# EAGLE schematic Circuit (EAGLE 8.2.2)
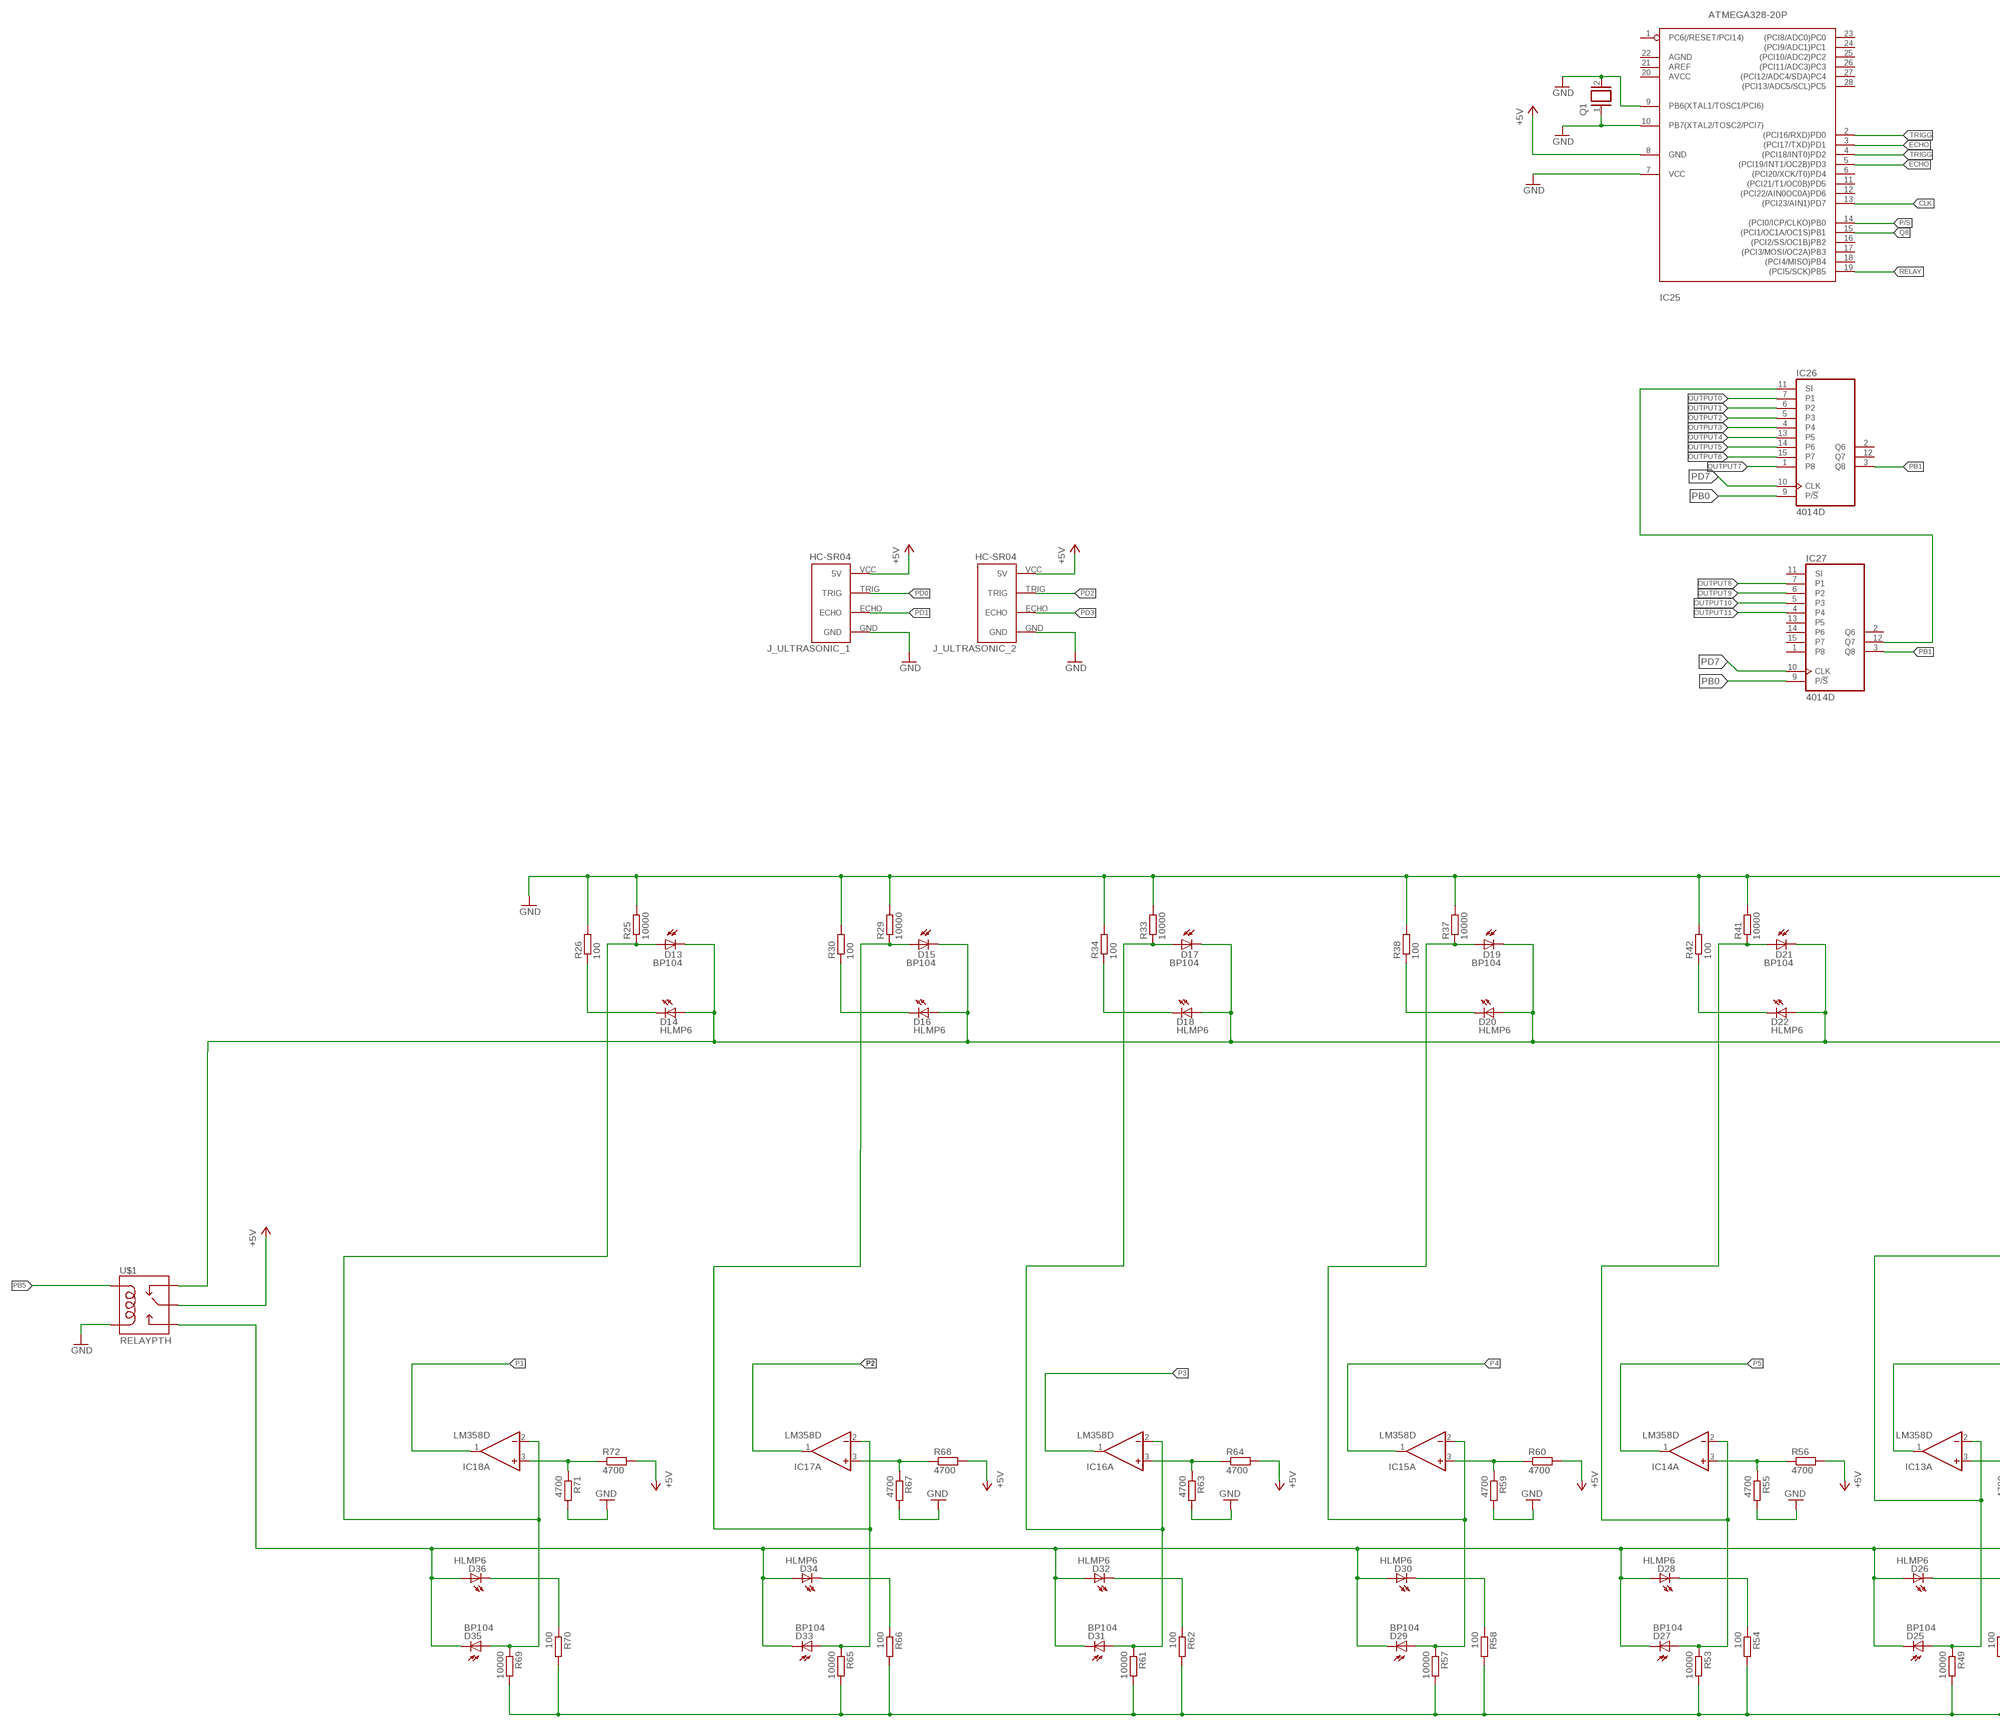
[diagram p0: schematic, sheet 1, part 1 of 2]
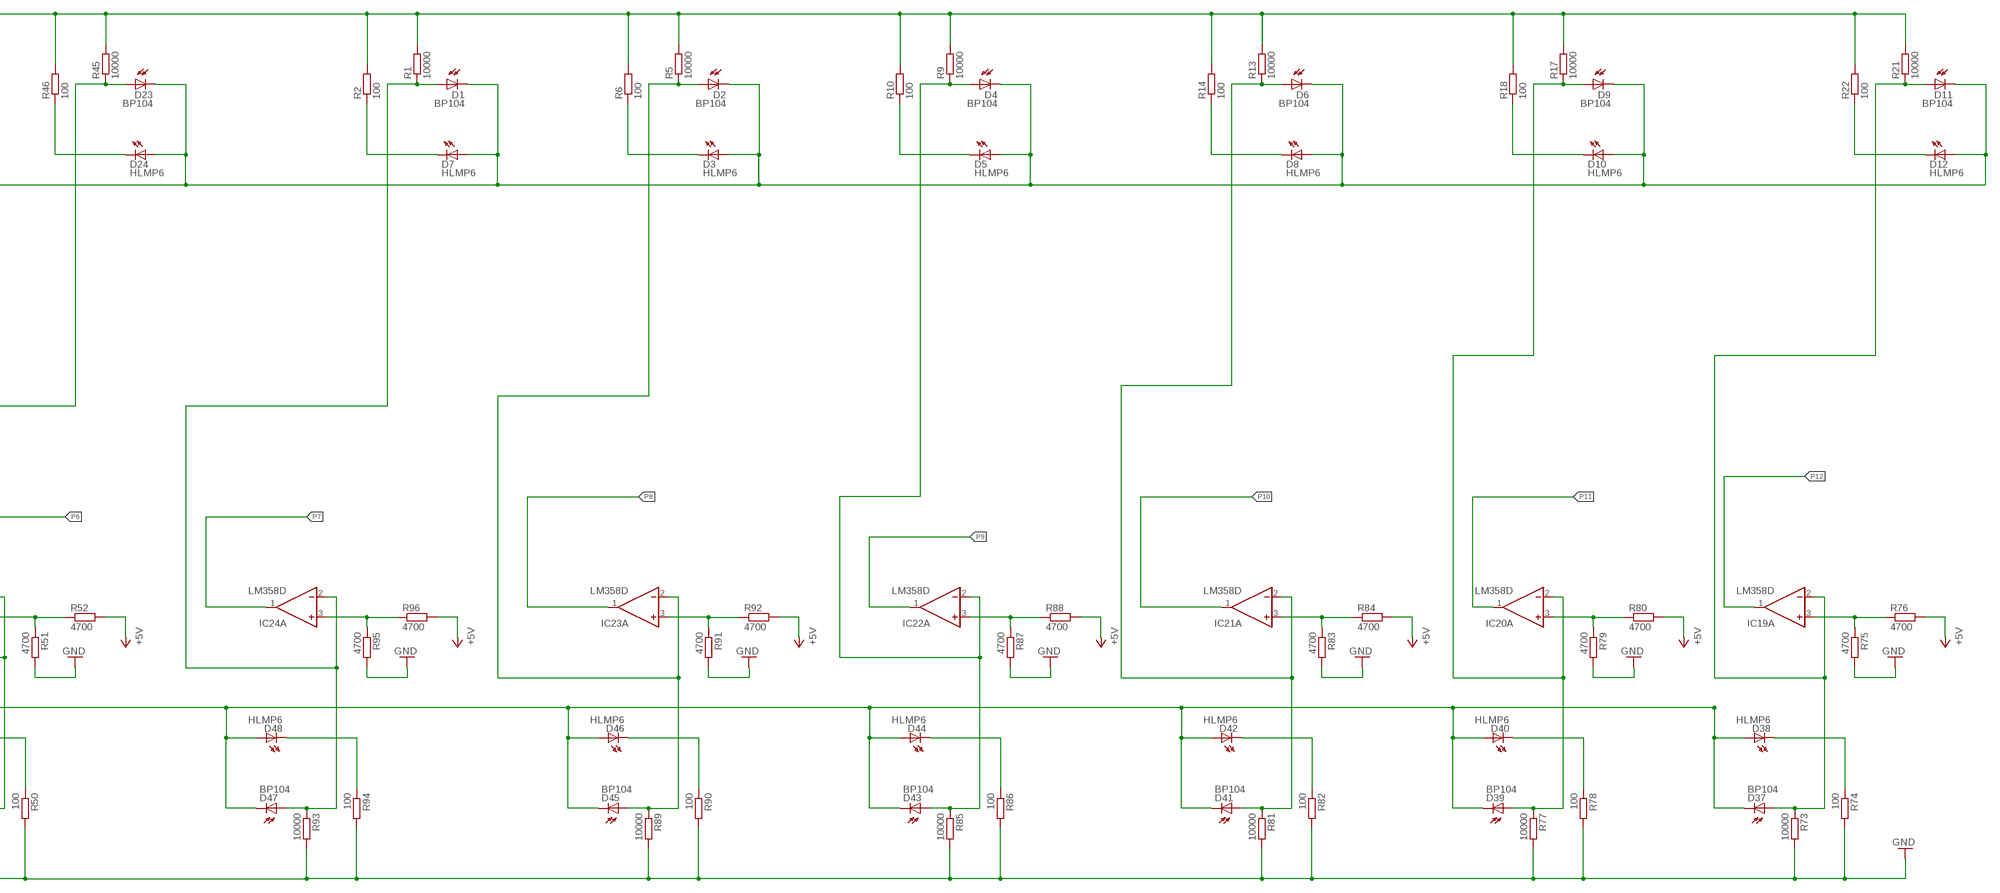
[diagram p1: schematic, sheet 1, part 2 of 2]

## Parts
D1  BP104  [BP104]
D2  BP104  [BP104]
D3  HLMP6  [HLMP6]
D4  BP104  [BP104]
D5  HLMP6  [HLMP6]
D6  BP104  [BP104]
D7  HLMP6  [HLMP6]
D8  HLMP6  [HLMP6]
D9  BP104  [BP104]
D10  HLMP6  [HLMP6]
D11  BP104  [BP104]
D12  HLMP6  [HLMP6]
D13  BP104  [BP104]
D14  HLMP6  [HLMP6]
D15  BP104  [BP104]
D16  HLMP6  [HLMP6]
D17  BP104  [BP104]
D18  HLMP6  [HLMP6]
D19  BP104  [BP104]
D20  HLMP6  [HLMP6]
D21  BP104  [BP104]
D22  HLMP6  [HLMP6]
D23  BP104  [BP104]
D24  HLMP6  [HLMP6]
D25  BP104  [BP104]
D26  HLMP6  [HLMP6]
D27  BP104  [BP104]
D28  HLMP6  [HLMP6]
D29  BP104  [BP104]
D30  HLMP6  [HLMP6]
D31  BP104  [BP104]
D32  HLMP6  [HLMP6]
D33  BP104  [BP104]
D34  HLMP6  [HLMP6]
D35  BP104  [BP104]
D36  HLMP6  [HLMP6]
D37  BP104  [BP104]
D38  HLMP6  [HLMP6]
D39  BP104  [BP104]
D40  HLMP6  [HLMP6]
D41  BP104  [BP104]
D42  HLMP6  [HLMP6]
D43  BP104  [BP104]
D44  HLMP6  [HLMP6]
D45  BP104  [BP104]
D46  HLMP6  [HLMP6]
D47  BP104  [BP104]
D48  HLMP6  [HLMP6]
IC13  LM358D  [SO08]
IC14  LM358D  [SO08]
IC15  LM358D  [SO08]
IC16  LM358D  [SO08]
IC17  LM358D  [SO08]
IC18  LM358D  [SO08]
IC19  LM358D  [SO08]
IC20  LM358D  [SO08]
IC21  LM358D  [SO08]
IC22  LM358D  [SO08]
IC23  LM358D  [SO08]
IC24  LM358D  [SO08]
IC25  ATMEGA328-20P  [DIL28-3]
IC26  4014D  [SO16]
IC27  4014D  [SO16]
J_ULTRASONIC_1  HC-SR04  [HC-SR04_FOOTPRINT]
J_ULTRASONIC_2  HC-SR04  [HC-SR04_FOOTPRINT]
Q1  XTAL  [Q]
R1  10000  R-EU_0204/2V  [0204V]
R2  100  R-EU_0204/2V  [0204V]
R5  10000  R-EU_0204/2V  [0204V]
R6  100  R-EU_0204/2V  [0204V]
R9  10000  R-EU_0204/2V  [0204V]
R10  100  R-EU_0204/2V  [0204V]
R13  10000  R-EU_0204/2V  [0204V]
R14  100  R-EU_0204/2V  [0204V]
R17  10000  R-EU_0204/2V  [0204V]
R18  100  R-EU_0204/2V  [0204V]
R21  10000  R-EU_0204/2V  [0204V]
R22  100  R-EU_0204/2V  [0204V]
R25  10000  R-EU_0204/2V  [0204V]
R26  100  R-EU_0204/2V  [0204V]
R29  10000  R-EU_0204/2V  [0204V]
R30  100  R-EU_0204/2V  [0204V]
R33  10000  R-EU_0204/2V  [0204V]
R34  100  R-EU_0204/2V  [0204V]
R37  10000  R-EU_0204/2V  [0204V]
R38  100  R-EU_0204/2V  [0204V]
R41  10000  R-EU_0204/2V  [0204V]
R42  100  R-EU_0204/2V  [0204V]
R45  10000  R-EU_0204/2V  [0204V]
R46  100  R-EU_0204/2V  [0204V]
R49  10000  R-EU_0204/2V  [0204V]
R50  100  R-EU_0204/2V  [0204V]
R51  4700  R-EU_0204/2V  [0204V]
R52  4700  R-EU_0204/2V  [0204V]
R53  10000  R-EU_0204/2V  [0204V]
R54  100  R-EU_0204/2V  [0204V]
R55  4700  R-EU_0204/2V  [0204V]
R56  4700  R-EU_0204/2V  [0204V]
R57  10000  R-EU_0204/2V  [0204V]
R58  100  R-EU_0204/2V  [0204V]
R59  4700  R-EU_0204/2V  [0204V]
R60  4700  R-EU_0204/2V  [0204V]
R61  10000  R-EU_0204/2V  [0204V]
R62  100  R-EU_0204/2V  [0204V]
R63  4700  R-EU_0204/2V  [0204V]
R64  4700  R-EU_0204/2V  [0204V]
R65  10000  R-EU_0204/2V  [0204V]
R66  100  R-EU_0204/2V  [0204V]
R67  4700  R-EU_0204/2V  [0204V]
R68  4700  R-EU_0204/2V  [0204V]
R69  10000  R-EU_0204/2V  [0204V]
R70  100  R-EU_0204/2V  [0204V]
R71  4700  R-EU_0204/2V  [0204V]
R72  4700  R-EU_0204/2V  [0204V]
R73  10000  R-EU_0204/2V  [0204V]
R74  100  R-EU_0204/2V  [0204V]
R75  4700  R-EU_0204/2V  [0204V]
R76  4700  R-EU_0204/2V  [0204V]
R77  10000  R-EU_0204/2V  [0204V]
R78  100  R-EU_0204/2V  [0204V]
R79  4700  R-EU_0204/2V  [0204V]
R80  4700  R-EU_0204/2V  [0204V]
R81  10000  R-EU_0204/2V  [0204V]
R82  100  R-EU_0204/2V  [0204V]
R83  4700  R-EU_0204/2V  [0204V]
R84  4700  R-EU_0204/2V  [0204V]
R85  10000  R-EU_0204/2V  [0204V]
R86  100  R-EU_0204/2V  [0204V]
R87  4700  R-EU_0204/2V  [0204V]
R88  4700  R-EU_0204/2V  [0204V]
R89  10000  R-EU_0204/2V  [0204V]
R90  100  R-EU_0204/2V  [0204V]
R91  4700  R-EU_0204/2V  [0204V]
R92  4700  R-EU_0204/2V  [0204V]
R93  10000  R-EU_0204/2V  [0204V]
R94  100  R-EU_0204/2V  [0204V]
R95  4700  R-EU_0204/2V  [0204V]
R96  4700  R-EU_0204/2V  [0204V]
U$1  RELAYPTH  [SRD-05VDC-SL-C]

## Nets
+5V: IC25.8(GND) J_ULTRASONIC_1.VCC(5V) J_ULTRASONIC_2.VCC(5V) R52.2 R56.2 R60.2 R64.2 R68.2 R72.2 R76.2 R80.2 R84.2 R88.2 R92.2 R96.2 U$1.SWCOMMON
CLK: IC25.13((PCI23/AIN1)PD7)
ECHO: IC25.3((PCI17/TXD)PD1) IC25.5((PCI19/INT1/OC2B)PD3)
GND: IC25.7(VCC) IC25.9(PB6(XTAL1/TOSC1/PCI6)) IC25.10(PB7(XTAL2/TOSC2/PCI7)) J_ULTRASONIC_1.GND J_ULTRASONIC_2.GND Q1.1 Q1.2 R1.2 R2.2 R5.2 R6.2 R9.2 R10.2 R13.2 R14.2 R17.2 R18.2 R21.2 R22.2 R25.2 R26.2 R29.2 R30.2 R33.2 R34.2 R37.2 R38.2 R41.2 R42.2 R45.2 R46.2 R49.2 R50.2 R51.2 R53.2 R54.2 R55.2 R57.2 R58.2 R59.2 R61.2 R62.2 R63.2 R65.2 R66.2 R67.2 R69.2 R70.2 R71.2 R73.2 R74.2 R75.2 R77.2 R78.2 R79.2 R81.2 R82.2 R83.2 R85.2 R86.2 R87.2 R89.2 R90.2 R91.2 R93.2 R94.2 R95.2 U$1.COIL0
N$1: D2.A D45.A IC23.2(A:-IN) R5.1 R89.1
N$2: D1.A D47.A IC24.2(A:-IN) R1.1 R93.1
N$4: D7.K R2.1
N$6: D3.K R6.1
N$7: D4.A D43.A IC22.2(A:-IN) R9.1 R85.1
N$9: D5.K R10.1
N$10: D6.A D41.A IC21.2(A:-IN) R13.1 R81.1
N$12: D8.K R14.1
N$13: D9.A D39.A IC20.2(A:-IN) R17.1 R77.1
N$15: D10.K R18.1
N$16: D11.A D37.A IC19.2(A:-IN) R21.1 R73.1
N$18: D12.K R22.1
N$21: D14.K R26.1
N$24: D16.K R30.1
N$25: D17.A D31.A IC16.2(A:-IN) R33.1 R61.1
N$27: D18.K R34.1
N$29: D25.K(C) D26.A D27.K(C) D28.A D29.K(C) D30.A D31.K(C) D32.A D33.K(C) D34.A D35.K(C) D36.A D37.K(C) D38.A D39.K(C) D40.A D41.K(C) D42.A D43.K(C) D44.A D45.K(C) D46.A D47.K(C) D48.A U$1.SWOPEN
N$30: D20.K R38.1
N$31: D21.A D27.A IC14.2(A:-IN) R41.1 R53.1
N$32: D1.K(C) D2.K(C) D3.A D4.K(C) D5.A D6.K(C) D7.A D8.A D9.K(C) D10.A D11.K(C) D12.A D13.K(C) D14.A D15.K(C) D16.A D17.K(C) D18.A D19.K(C) D20.A D21.K(C) D22.A D23.K(C) D24.A U$1.SWCLOSED(SWCLOSE)
N$33: D22.K R42.1
N$34: D23.A D25.A IC13.2(A:-IN) R45.1 R49.1
N$36: D24.K R46.1
N$38: IC13.3(A:+IN) R51.1 R52.1
N$39: D26.K R50.1
N$41: IC14.3(A:+IN) R55.1 R56.1
N$42: D28.K R54.1
N$43: D19.A D29.A IC15.2(A:-IN) R37.1 R57.1
N$44: IC15.3(A:+IN) R59.1 R60.1
N$45: D30.K R58.1
N$47: IC16.3(A:+IN) R63.1 R64.1
N$48: D32.K R62.1
N$49: D15.A D33.A IC17.2(A:-IN) R29.1 R65.1
N$50: IC17.3(A:+IN) R67.1 R68.1
N$51: D34.K R66.1
N$52: D13.A D35.A IC18.2(A:-IN) R25.1 R69.1
N$53: IC18.3(A:+IN) R71.1 R72.1
N$54: D36.K R70.1
N$56: IC19.3(A:+IN) R75.1 R76.1
N$57: D38.K R74.1
N$59: IC20.3(A:+IN) R79.1 R80.1
N$60: D40.K R78.1
N$62: IC21.3(A:+IN) R83.1 R84.1
N$63: D42.K R82.1
N$65: IC22.3(A:+IN) R87.1 R88.1
N$66: D44.K R86.1
N$68: IC23.3(A:+IN) R91.1 R92.1
N$69: D46.K R90.1
N$71: IC24.3(A:+IN) R95.1 R96.1
N$72: D48.K R94.1
N$76: IC26.9(P/!S)
N$81: IC27.9(P/!S)
N$82: IC26.11(SI) IC27.12(Q7)
OUTPUT0: IC26.7(P1)
OUTPUT1: IC26.6(P2)
OUTPUT2: IC26.5(P3)
OUTPUT3: IC26.4
OUTPUT4: IC26.13(P5)
OUTPUT5: IC26.14(P6)
OUTPUT6: IC26.15(P7)
OUTPUT7: IC26.1(P8)
OUTPUT8: IC27.7(P1)
OUTPUT9: IC27.6(P2)
OUTPUT10: IC27.5(P3)
OUTPUT11: IC27.4
P1: IC18.1(A:OUT)
P2: IC17.1(A:OUT)
P3: IC16.1(A:OUT)
P4: IC15.1(A:OUT)
P5: IC14.1(A:OUT)
P6: IC13.1(A:OUT)
P7: IC24.1(A:OUT)
P8: IC23.1(A:OUT)
P9: IC22.1(A:OUT)
P10: IC21.1(A:OUT)
P11: IC20.1(A:OUT)
P12: IC19.1(A:OUT)
P/S: IC25.14((PCI0/ICP/CLKO)PB0)
PB0: IC26.10(CLK) IC27.10(CLK)
PB1: IC26.3(Q8) IC27.3(Q8)
PB5: U$1.COIL1
PD0: J_ULTRASONIC_1.TRIG
PD1: J_ULTRASONIC_1.ECHO
PD2: J_ULTRASONIC_2.TRIG
PD3: J_ULTRASONIC_2.ECHO
Q8: IC25.15((PCI1/OC1A/OC1S)PB1)
RELAY: IC25.19((PCI5/SCK)PB5)
TRIGG: IC25.2((PCI16/RXD)PD0) IC25.4((PCI18/INT0)PD2)
Unconnected: IC13.5(B:+IN) IC13.6(B:-IN) IC13.7(B:OUT) IC14.5(B:+IN) IC14.6(B:-IN) IC14.7(B:OUT) IC15.5(B:+IN) IC15.6(B:-IN) IC15.7(B:OUT) IC16.5(B:+IN) IC16.6(B:-IN) IC16.7(B:OUT) IC17.5(B:+IN) IC17.6(B:-IN) IC17.7(B:OUT) IC18.5(B:+IN) IC18.6(B:-IN) IC18.7(B:OUT) IC19.5(B:+IN) IC19.6(B:-IN) IC19.7(B:OUT) IC20.5(B:+IN) IC20.6(B:-IN) IC20.7(B:OUT) IC21.5(B:+IN) IC21.6(B:-IN) IC21.7(B:OUT) IC22.5(B:+IN) IC22.6(B:-IN) IC22.7(B:OUT) IC23.5(B:+IN) IC23.6(B:-IN) IC23.7(B:OUT) IC24.5(B:+IN) IC24.6(B:-IN) IC24.7(B:OUT) IC25.1(PC6(/RESET/PCI14)) IC25.6((PCI20/XCK/T0)PD4) IC25.11((PCI21/T1/OC0B)PD5) IC25.12((PCI22/AIN0OC0A)PD6) IC25.16((PCI2/SS/OC1B)PB2) IC25.17((PCI3/MOSI/OC2A)PB3) IC25.18((PCI4/MISO)PB4) IC25.20(AVCC) IC25.21(AREF) IC25.22(AGND) IC25.23((PCI8/ADC0)PC0) IC25.24((PCI9/ADC1)PC1) IC25.25((PCI10/ADC2)PC2) IC25.26((PCI11/ADC3)PC3) IC25.27((PCI12/ADC4/SDA)PC4) IC25.28((PCI13/ADC5/SCL)PC5) IC26.2(Q6) IC26.12(Q7) IC27.1(P8) IC27.2(Q6) IC27.11(SI) IC27.13(P5) IC27.14(P6) IC27.15(P7)

## Power pins joined to a net without a drawn wire
V+: IC13.8(P:V+) IC14.8(P:V+) IC15.8(P:V+) IC16.8(P:V+) IC17.8(P:V+) IC18.8(P:V+) IC19.8(P:V+) IC20.8(P:V+) IC21.8(P:V+) IC22.8(P:V+) IC23.8(P:V+) IC24.8(P:V+)
V-: IC13.4(P:V-) IC14.4(P:V-) IC15.4(P:V-) IC16.4(P:V-) IC17.4(P:V-) IC18.4(P:V-) IC19.4(P:V-) IC20.4(P:V-) IC21.4(P:V-) IC22.4(P:V-) IC23.4(P:V-) IC24.4(P:V-)
VDD: IC26.16(VDD) IC27.16(VDD)
VSS: IC26.8(VSS) IC27.8(VSS)

## Library data of the parts
D1 D2 D4 D6 D9 D11 D13 D15 D17 D19 D21 D23 D25 D27 D29 D31 D33 D35 D37 D39 D41 D43 D45 D47 = opto-trans-siemens:BP104: PHOTO DIODE; MF: VISHAY/TELEFUNKEN; MPN: BP104; OC_FARNELL: 1779636; OC_NEWARK: 14M4504
D3 D5 D7 D8 D10 D12 D14 D16 D18 D20 D22 D24 D26 D28 D30 D32 D34 D36 D38 D40 D42 D44 D46 D48 = display-hp:HLMP6: LED 2mm horizontal; MF: AGILENT TECHNOLOGIES; MPN: HLMP-6500; OC_FARNELL: 1652490; OC_NEWARK: 40K0088
IC13-IC24 = linear:LM358: OP AMP also LM158; LM258; LM2904 Source: http://cache.national.com/ds/LM/LM158.pdf
IC25 = atmega328:ATMEGA328*P: MICROCONTROLLER 32 kBytes FLASH 2 kBytes SRAM 1 kBytes EEPROM USART 8-channel 10 bit ADC
IC26 IC27 = 40xx:4014: 8-bit static SHIFT REGISTER
J_ULTRASONIC_1 J_ULTRASONIC_2 = Ultrasonic-sensor:HC-SR04: Ultrasonic Sensor HC-SR04
Q1 = special:XTAL: CRYSTAL
R1 R2 R5 R6 R9 R10 R13 R14 R17 R18 R21 R22 R25 R26 R29 R30 R33 R34 R37 R38 R41 R42 R45 R46 R49-R96 = rcl:R-EU_: RESISTOR, European symbol
U$1 = relay:RELAY: SPDT relay (COM-00101)